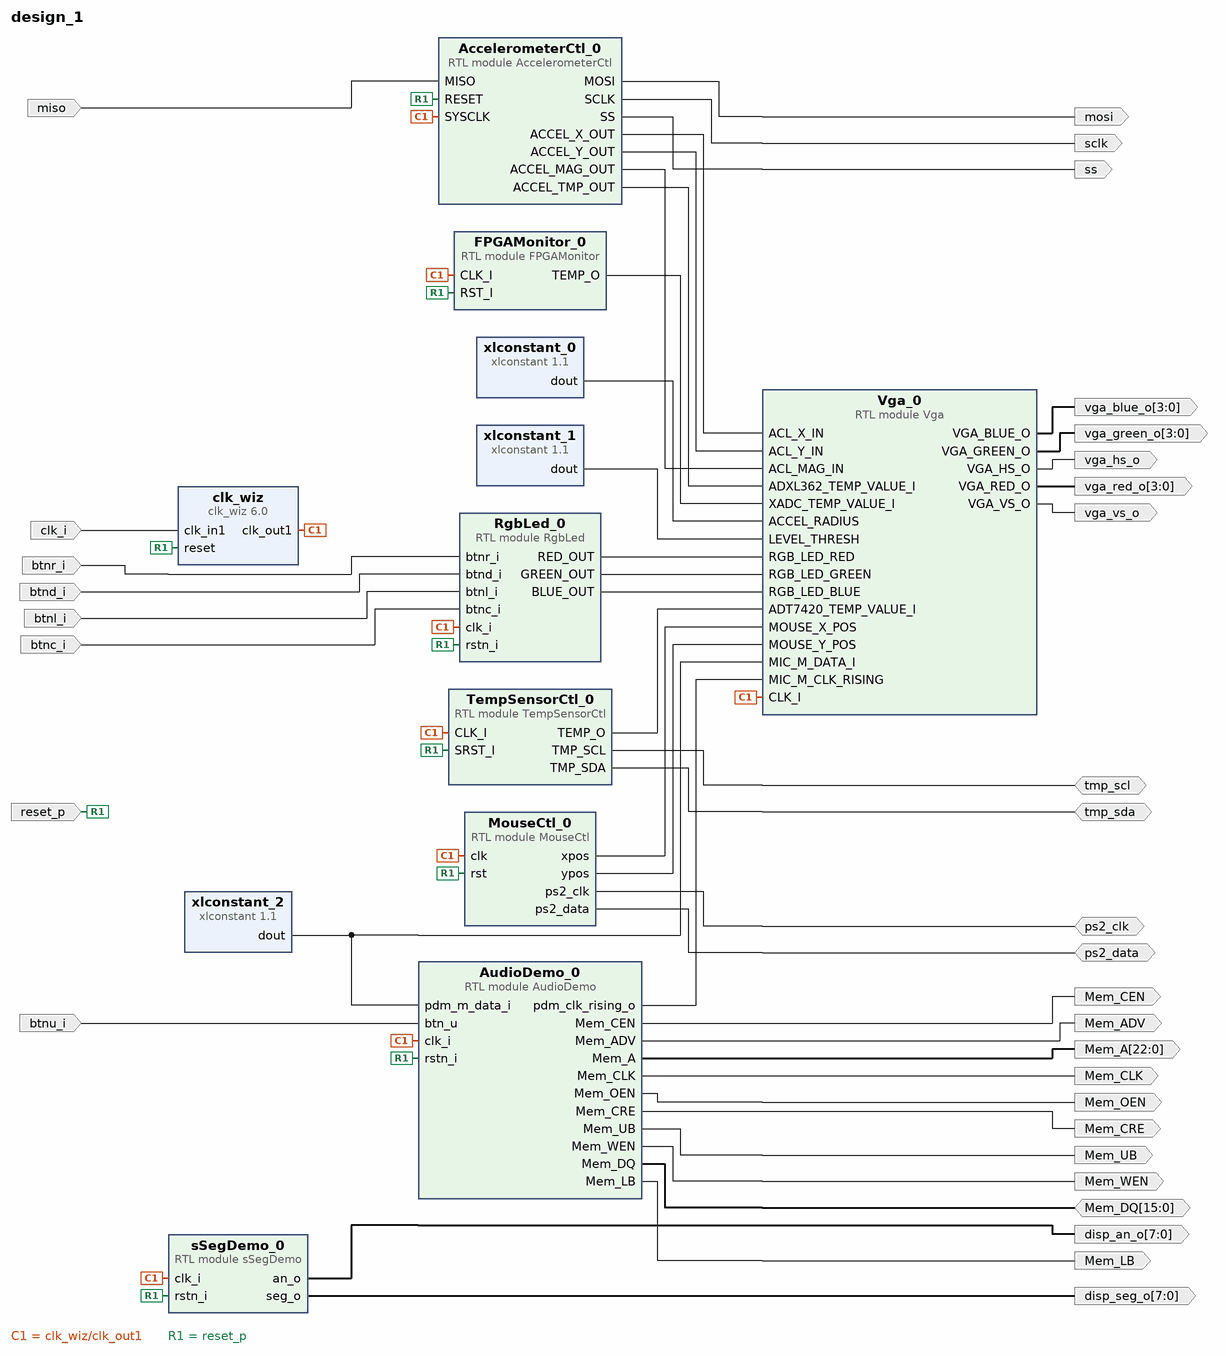
[diagram p0: block diagram of the top level]
# Vivado block design design_1, xc7a100tcsg324-1, Vivado 2019.2
create_bd_design design_1

create_bd_port -dir I btnr_i
create_bd_port -dir I btnd_i
create_bd_port -dir IO -type clk ps2_clk
set_property -dict {CONFIG.FREQ_HZ 100000000} [get_bd_ports ps2_clk]
create_bd_port -dir I -type clk clk_i
set_property -dict {CONFIG.CLK_DOMAIN design_1_sys_clock CONFIG.FREQ_HZ 100000000} [get_bd_ports clk_i]
create_bd_port -dir O Mem_CEN
create_bd_port -dir O Mem_OEN
create_bd_port -dir O Mem_WEN
create_bd_port -dir O Mem_UB
create_bd_port -dir O Mem_ADV
create_bd_port -dir O -type clk Mem_CLK
create_bd_port -dir O Mem_CRE
create_bd_port -dir O Mem_LB
create_bd_port -dir IO -from 15 -to 0 Mem_DQ
create_bd_port -dir O -from 22 -to 0 Mem_A
create_bd_port -dir I -type rst reset_p
set_property -dict {CONFIG.POLARITY ACTIVE_HIGH} [get_bd_ports reset_p]
create_bd_port -dir I btnl_i
create_bd_port -dir I btnc_i
create_bd_port -dir I btnu_i
create_bd_port -dir O vga_hs_o
create_bd_port -dir O vga_vs_o
create_bd_port -dir O -from 3 -to 0 vga_red_o
create_bd_port -dir O -from 3 -to 0 vga_green_o
create_bd_port -dir O -from 3 -to 0 vga_blue_o
create_bd_port -dir O sclk
create_bd_port -dir O mosi
create_bd_port -dir O ss
create_bd_port -dir I miso
create_bd_port -dir IO tmp_scl
create_bd_port -dir IO tmp_sda
create_bd_port -dir O -from 7 -to 0 disp_seg_o
create_bd_port -dir O -from 7 -to 0 disp_an_o
create_bd_port -dir IO ps2_data

create_bd_cell -type module -reference RgbLed RgbLed_0
create_bd_cell -type module -reference sSegDemo sSegDemo_0
create_bd_cell -type module -reference AudioDemo AudioDemo_0
create_bd_cell -type module -reference FPGAMonitor FPGAMonitor_0
create_bd_cell -type module -reference TempSensorCtl TempSensorCtl_0
create_bd_cell -type module -reference AccelerometerCtl AccelerometerCtl_0
create_bd_cell -type ip -vlnv xilinx.com:ip:clk_wiz:6.0 clk_wiz
set_property -dict [list \
  CONFIG.CLK_IN1_BOARD_INTERFACE sys_clock \
  CONFIG.RESET_BOARD_INTERFACE reset \
  CONFIG.USE_BOARD_FLOW true \
] [get_bd_cells clk_wiz]
create_bd_cell -type module -reference MouseCtl MouseCtl_0
create_bd_cell -type ip -vlnv xilinx.com:ip:xlconstant:1.1 xlconstant_0
set_property -dict {CONFIG.CONST_VAL 007 CONFIG.CONST_WIDTH 12} [get_bd_cells xlconstant_0]
create_bd_cell -type ip -vlnv xilinx.com:ip:xlconstant:1.1 xlconstant_1
set_property -dict {CONFIG.CONST_VAL 020 CONFIG.CONST_WIDTH 12} [get_bd_cells xlconstant_1]
create_bd_cell -type module -reference Vga Vga_0
create_bd_cell -type ip -vlnv xilinx.com:ip:xlconstant:1.1 xlconstant_2

# ---- connections ----

connect_bd_net [get_bd_pins clk_wiz/clk_out1] \
  [get_bd_pins sSegDemo_0/clk_i] [get_bd_pins AudioDemo_0/clk_i] [get_bd_pins FPGAMonitor_0/CLK_I] \
  [get_bd_pins RgbLed_0/clk_i] [get_bd_pins TempSensorCtl_0/CLK_I] [get_bd_pins AccelerometerCtl_0/SYSCLK] \
  [get_bd_pins MouseCtl_0/clk] [get_bd_pins Vga_0/CLK_I]
connect_bd_net [get_bd_pins TempSensorCtl_0/TEMP_O] [get_bd_pins Vga_0/ADT7420_TEMP_VALUE_I]
connect_bd_net [get_bd_ports btnr_i] [get_bd_pins RgbLed_0/btnr_i]
connect_bd_net [get_bd_ports btnd_i] [get_bd_pins RgbLed_0/btnd_i]
connect_bd_net [get_bd_pins AccelerometerCtl_0/ACCEL_X_OUT] [get_bd_pins Vga_0/ACL_X_IN]
connect_bd_net [get_bd_pins AccelerometerCtl_0/ACCEL_Y_OUT] [get_bd_pins Vga_0/ACL_Y_IN]
connect_bd_net [get_bd_pins AccelerometerCtl_0/ACCEL_MAG_OUT] [get_bd_pins Vga_0/ACL_MAG_IN]
connect_bd_net [get_bd_pins RgbLed_0/RED_OUT] [get_bd_pins Vga_0/RGB_LED_RED]
connect_bd_net [get_bd_pins RgbLed_0/GREEN_OUT] [get_bd_pins Vga_0/RGB_LED_GREEN]
connect_bd_net [get_bd_pins RgbLed_0/BLUE_OUT] [get_bd_pins Vga_0/RGB_LED_BLUE]
connect_bd_net [get_bd_pins xlconstant_2/dout] [get_bd_pins AudioDemo_0/pdm_m_data_i] [get_bd_pins Vga_0/MIC_M_DATA_I]
connect_bd_net [get_bd_pins AudioDemo_0/pdm_clk_rising_o] [get_bd_pins Vga_0/MIC_M_CLK_RISING]
connect_bd_net [get_bd_pins FPGAMonitor_0/TEMP_O] [get_bd_pins Vga_0/XADC_TEMP_VALUE_I]
connect_bd_net [get_bd_pins AccelerometerCtl_0/ACCEL_TMP_OUT] [get_bd_pins Vga_0/ADXL362_TEMP_VALUE_I]
connect_bd_net [get_bd_pins MouseCtl_0/xpos] [get_bd_pins Vga_0/MOUSE_X_POS]
connect_bd_net [get_bd_pins MouseCtl_0/ypos] [get_bd_pins Vga_0/MOUSE_Y_POS]
connect_bd_net [get_bd_ports ps2_clk] [get_bd_pins MouseCtl_0/ps2_clk]
connect_bd_net [get_bd_pins xlconstant_0/dout] [get_bd_pins Vga_0/ACCEL_RADIUS]
connect_bd_net [get_bd_pins xlconstant_1/dout] [get_bd_pins Vga_0/LEVEL_THRESH]
connect_bd_net [get_bd_ports clk_i] [get_bd_pins clk_wiz/clk_in1]
connect_bd_net [get_bd_pins AudioDemo_0/Mem_CEN] [get_bd_ports Mem_CEN]
connect_bd_net [get_bd_pins AudioDemo_0/Mem_OEN] [get_bd_ports Mem_OEN]
connect_bd_net [get_bd_pins AudioDemo_0/Mem_WEN] [get_bd_ports Mem_WEN]
connect_bd_net [get_bd_pins AudioDemo_0/Mem_UB] [get_bd_ports Mem_UB]
connect_bd_net [get_bd_pins AudioDemo_0/Mem_ADV] [get_bd_ports Mem_ADV]
connect_bd_net [get_bd_pins AudioDemo_0/Mem_CLK] [get_bd_ports Mem_CLK]
connect_bd_net [get_bd_pins AudioDemo_0/Mem_CRE] [get_bd_ports Mem_CRE]
connect_bd_net [get_bd_pins AudioDemo_0/Mem_LB] [get_bd_ports Mem_LB]
connect_bd_net [get_bd_ports Mem_DQ] [get_bd_pins AudioDemo_0/Mem_DQ]
connect_bd_net [get_bd_pins AudioDemo_0/Mem_A] [get_bd_ports Mem_A]
connect_bd_net [get_bd_ports reset_p] \
  [get_bd_pins clk_wiz/reset] [get_bd_pins RgbLed_0/rstn_i] [get_bd_pins MouseCtl_0/rst] [get_bd_pins FPGAMonitor_0/RST_I] \
  [get_bd_pins AccelerometerCtl_0/RESET] [get_bd_pins sSegDemo_0/rstn_i] [get_bd_pins TempSensorCtl_0/SRST_I] \
  [get_bd_pins AudioDemo_0/rstn_i]
connect_bd_net -net btnl_i_0_1 [get_bd_ports btnl_i] [get_bd_pins RgbLed_0/btnl_i]
connect_bd_net -net btnc_i_0_1 [get_bd_ports btnc_i] [get_bd_pins RgbLed_0/btnc_i]
connect_bd_net [get_bd_ports btnu_i] [get_bd_pins AudioDemo_0/btn_u]
connect_bd_net [get_bd_pins Vga_0/VGA_HS_O] [get_bd_ports vga_hs_o]
connect_bd_net [get_bd_pins Vga_0/VGA_VS_O] [get_bd_ports vga_vs_o]
connect_bd_net [get_bd_pins Vga_0/VGA_RED_O] [get_bd_ports vga_red_o]
connect_bd_net [get_bd_pins Vga_0/VGA_GREEN_O] [get_bd_ports vga_green_o]
connect_bd_net [get_bd_pins Vga_0/VGA_BLUE_O] [get_bd_ports vga_blue_o]
connect_bd_net [get_bd_pins AccelerometerCtl_0/SCLK] [get_bd_ports sclk]
connect_bd_net [get_bd_pins AccelerometerCtl_0/MOSI] [get_bd_ports mosi]
connect_bd_net [get_bd_pins AccelerometerCtl_0/SS] [get_bd_ports ss]
connect_bd_net [get_bd_ports miso] [get_bd_pins AccelerometerCtl_0/MISO]
connect_bd_net [get_bd_ports tmp_scl] [get_bd_pins TempSensorCtl_0/TMP_SCL]
connect_bd_net [get_bd_ports tmp_sda] [get_bd_pins TempSensorCtl_0/TMP_SDA]
connect_bd_net [get_bd_pins sSegDemo_0/seg_o] [get_bd_ports disp_seg_o]
connect_bd_net [get_bd_pins sSegDemo_0/an_o] [get_bd_ports disp_an_o]
connect_bd_net [get_bd_ports ps2_data] [get_bd_pins MouseCtl_0/ps2_data]

validate_bd_design
save_bd_design
